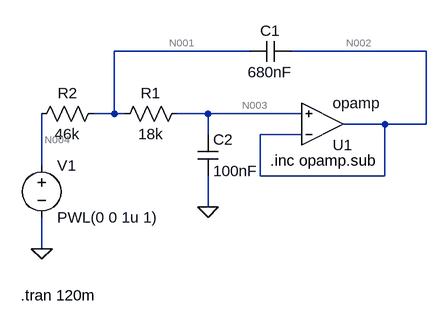
[diagram p0: schematic Draft2.asc]
Draft2.asc, the LTspice schematic file:
Version 4
SHEET 1 880 680
WIRE 80 64 -128 64
WIRE 352 64 144 64
WIRE -128 160 -128 64
WIRE -128 160 -160 160
WIRE -112 160 -128 160
WIRE 16 160 -32 160
WIRE 160 160 16 160
WIRE 288 176 224 176
WIRE 352 176 352 64
WIRE 352 176 288 176
WIRE 16 192 16 160
WIRE 160 192 96 192
WIRE -240 240 -240 160
WIRE 96 256 96 192
WIRE 288 256 288 176
WIRE 288 256 96 256
WIRE 16 304 16 256
WIRE -240 368 -240 320
FLAG 16 304 0
FLAG -240 368 0
SYMBOL cap 144 48 R90
WINDOW 0 0 32 VBottom 2
WINDOW 3 32 32 VTop 2
SYMATTR InstName C1
SYMATTR Value 680nF
SYMBOL cap 0 192 R0
SYMATTR InstName C2
SYMATTR Value 100nF
SYMBOL res -16 144 R90
WINDOW 0 0 56 VBottom 2
WINDOW 3 32 56 VTop 2
SYMATTR InstName R1
SYMATTR Value 18k
SYMBOL res -144 144 R90
WINDOW 0 0 56 VBottom 2
WINDOW 3 32 56 VTop 2
SYMATTR InstName R2
SYMATTR Value 46k
SYMBOL voltage -240 224 R0
WINDOW 123 0 0 Left 0
WINDOW 39 0 0 Left 0
SYMATTR InstName V1
SYMATTR Value PWL(0 0 1u 1)
SYMBOL OpAmps\\opamp 192 240 M180
SYMATTR InstName U1
TEXT -272 440 Left 2 !.tran 120m
TEXT 112 232 Left 2 !.inc opamp.sub

The netlist it stands for:
* Draft2.asc
C1 N002 N001 680nF
C2 N003 0 100nF
R1 N003 N001 18k
R2 N001 N004 46k
V1 N004 0 PWL(0 0 1u 1)
XU1 N002 N003 N002 opamp Aol=100K GBW=10Meg  ; pins invin noninvin out
.tran 120m
.inc opamp.sub
.backanno
.end

* Results of the author's LTspice run, read from the files saved beside the schematic
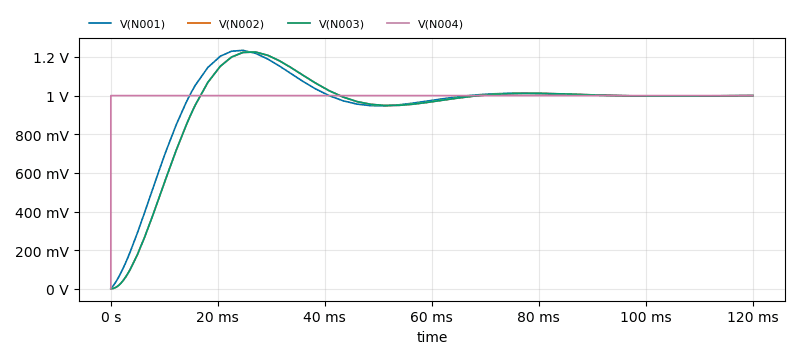
[diagram p1: Transient Analysis of Draft2.asc, plotted from the saved traces]
* Transient Analysis, 1 run:
*   V(N001): min 0 V, max 1.234 V, average 961.4 mV, rms 986.6 mV, last 1 V
*   V(N002): min 0 V, max 1.225 V, average 946.4 mV, rms 977.9 mV, last 999.9 mV
*   V(N003): min 0 V, max 1.226 V, average 946.4 mV, rms 977.9 mV, last 999.9 mV
*   V(N004): min 0 V, max 1 V, average 1 V, rms 1 V, last 1 V